# Altium project Extender_Remastered_V1.PrjPcb
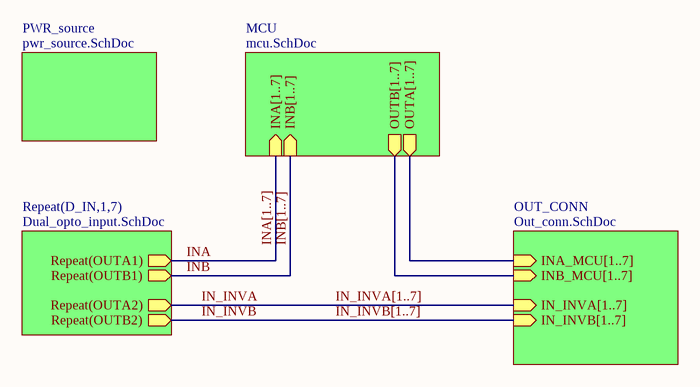
[diagram p0: main.SchDoc]
4 sheets, 123 parts. Net scope: hierarchical (ports join the sheet entries above them; power ports are global).
Board file: Extender_Remastered_V1.PcbDoc
Sheets:
  main.SchDoc
    D_IN1 = Dual_opto_input.SchDoc
    D_IN2 = Dual_opto_input.SchDoc
    D_IN3 = Dual_opto_input.SchDoc
    D_IN4 = Dual_opto_input.SchDoc
    D_IN5 = Dual_opto_input.SchDoc
    D_IN6 = Dual_opto_input.SchDoc
    D_IN7 = Dual_opto_input.SchDoc
    MCU = mcu.SchDoc
    OUT_CONN = Out_conn.SchDoc

## Sheet main.SchDoc
size A4; DocumentNumber: 1; SheetNumber: 1; SheetTotal: 5

### Sub-sheets
MCU = mcu.SchDoc: INA[1..7] (in), INB[1..7] (in), OUTB[1..7] (out), OUTA[1..7] (out)
OUT_CONN = Out_conn.SchDoc: IN_INVA[1..7] (in), IN_INVB[1..7] (in), INA_MCU[1..7] (in), INB_MCU[1..7] (in)
PWR_source = pwr_source.SchDoc (file not in this document): no entries
Repeat(D_IN,1,7) = Dual_opto_input.SchDoc: Repeat(OUTA1) (out), Repeat(OUTB1) (out), Repeat(OUTA2) (out), Repeat(OUTB2) (out)

### Nets
IN_INVA: sheet Repeat(D_IN,1,7)/Repeat(OUTA2)
IN_INVB: sheet Repeat(D_IN,1,7)/Repeat(OUTB2)
INA: sheet Repeat(D_IN,1,7)/Repeat(OUTA1)
INB: sheet Repeat(D_IN,1,7)/Repeat(OUTB1)

### Buses and harness runs
bus IN_INVA[1..7] = sheet OUT_CONN/IN_INVA[1..7]
bus IN_INVB[1..7] = sheet OUT_CONN/IN_INVB[1..7]
bus INA[1..7] = sheet MCU/INA[1..7]
bus INB[1..7] = sheet MCU/INB[1..7]
bus sheet MCU/OUTA[1..7] = sheet OUT_CONN/INA_MCU[1..7]
bus sheet MCU/OUTB[1..7] = sheet OUT_CONN/INB_MCU[1..7]

## Sheet Dual_opto_input.SchDoc
size A4; DocumentNumber: 2; SheetNumber: 2; SheetTotal: 5
Used 7 times, as channels D_IN1, D_IN2, D_IN3, D_IN4, D_IN5, D_IN6, D_IN7. Parts and nets are listed once, with the designators drawn on the sheet.
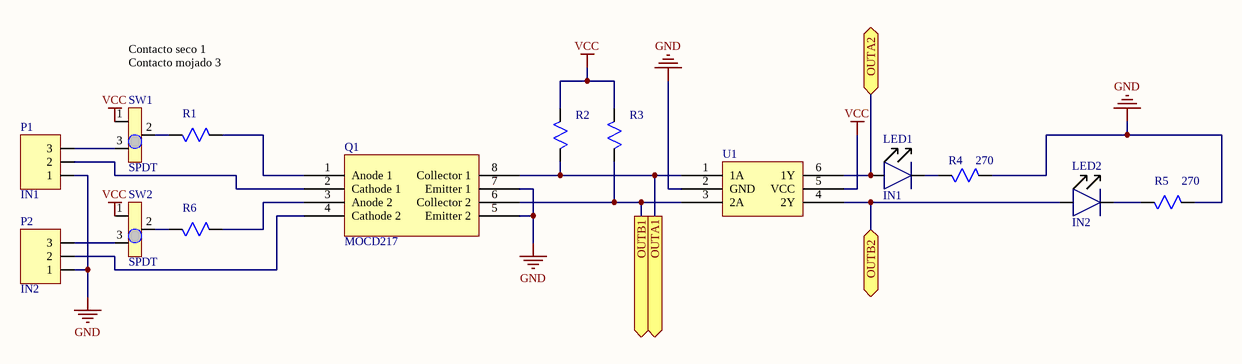
[diagram p1: Dual_opto_input.SchDoc]

### Parts
LED1  IN1  [SMD1206]
LED2  IN2  [SMD1206]
P1  IN1  [TBHDR3P3.5]
P2  IN2  [TBHDR3P3.5]
Q1  MOCD217  [SOIC8]
R1  (no value)  [ResistorSMD0805]
R2  (no value)  [ResistorSMD0805]
R3  (no value)  [ResistorSMD0805]
R4  270  [ResistorSMD0805]
R5  270  [ResistorSMD0805]
R6  (no value)  [ResistorSMD0805]
SW1  SPDT  [SPDT SMD]
SW2  SPDT  [SPDT SMD]
U1  Inverter2x2  [Inverter2x2]  (value not drawn)

### Ports
OUTA1 (out), OUTA2, OUTB1 (out), OUTB2

### Nets
GND: P1.1 P2.1 Q1.5(Emitter_2) Q1.7(Emitter_1) R4.1 R5.1 U1.2(GND)
VCC: R2.1 R3.1 SW1.1 SW2.1 U1.5(VCC)
OUTA1: Q1.8(Collector_1) R2.2 U1.1(1A) ; port OUTA1
OUTA2: LED1.2 U1.6(1Y) ; port OUTA2
OUTB1: Q1.6(Collector_2) R3.2 U1.3(2A) ; port OUTB1
OUTB2: LED2.2 U1.4(2Y) ; port OUTB2
NetLED1_1: LED1.1 R4.2
NetLED2_1: LED2.1 R5.2
NetP1_2: P1.2 Q1.2(Cathode_1)
NetP1_3: P1.3 SW1.3
NetP2_2: P2.2 Q1.4(Cathode_2)
NetP2_3: P2.3 SW2.3
NetQ1_1: Q1.1(Anode_1) R1.1
NetQ1_3: Q1.3(Anode_2) R6.1
NetR1_2: R1.2 SW1.2
NetR6_2: R6.2 SW2.2

### Channels
D_IN1: designators end in A; ports OUTA1=INA1 OUTA2=IN_INVA1 OUTB1=INB1 OUTB2=IN_INVB1
D_IN2: designators end in B; ports OUTA1=INA2 OUTA2=IN_INVA2 OUTB1=INB2 OUTB2=IN_INVB2
D_IN3: designators end in C; ports OUTA1=INA3 OUTA2=IN_INVA3 OUTB1=INB3 OUTB2=IN_INVB3
D_IN4: designators end in D; ports OUTA1=INA4 OUTA2=IN_INVA4 OUTB1=INB4 OUTB2=IN_INVB4
D_IN5: designators end in E; ports OUTA1=INA5 OUTA2=IN_INVA5 OUTB1=INB5 OUTB2=IN_INVB5
D_IN6: designators end in F; ports OUTA1=INA6 OUTA2=IN_INVA6 OUTB1=INB6 OUTB2=IN_INVB6
D_IN7: designators end in G; ports OUTA1=INA7 OUTA2=IN_INVA7 OUTB1=INB7 OUTB2=IN_INVB7

### Notes on the sheet
- Contacto seco 1
  Contacto mojado 3

### Library data of the parts
LED1 LED2 = LedSMD: Discrete Led SMD; Manufacturer Name: Lite-On Inc.; Manufacturers Part Number: LTST-C150GKT; PartDescription: LED GREEN CLEAR 1206 SMD; Digi-Key Part Number: 160-1169-1-ND; Package: 1206 (3216 Metric); Type: SMD
P1 P2 = TBHDR3P3.5: Connector 3 positions with pitch 3.5mm; Manufacturer Name: Phoenix Contact; Manufacturers Part Number: 1897102; PartDescription: TERM BLOCK HDR 3POS 90DEG 3.5MM; Accesorios PN: 277-2413-ND; Digi-Key Part Number: 277-11008-ND; Package: 3POS; Type: Thru-hole
Q1 = MOCD217: Optocoupler; Manufacturer Name: ON Semiconductor; Manufacturers Part Number: MOCD217R2M; PartDescription: OPTOISO 2.5KV 2CH TRANS 8SOIC; Type: SMD; Digi-Key Part Number: MOCD217R2MCT-ND; Package: 8-SOIC
R1-R3 R6 = ResistorSMD: Chip Resistor SMD; Manufacturer Name: Yageo; Manufacturers Part Number: RC0805FR-07680RL; PartDescription: RES SMD 680 OHM 1% 1/8W 0805; Digi-Key Part Number: 311-680CRCT-ND; Package: 0805; Type: SMD
R4 R5 = ResistorSMD: Chip Resistor SMD; Manufacturer Name: Yageo; Manufacturers Part Number: AC0805FR-07270RL; PartDescription: RES SMD 270 OHM 1% 1/8W 0805; Digi-Key Part Number: YAG3714CT-ND; Package: 0805; value: 270; Type: SMD
SW1 SW2 = SW_SPDT: 200mA 12V; Manufacturer Name: Nidec Copal Electronics; Manufacturers Part Number: CL-SB-12B-01T; PartDescription: SWITCH SLIDE SPDT 200MA 12V; Digi-Key Part Number: 563-1318-1-ND; Package: SMD; Type: SMD
U1 = Inverter2x2: Logic Inverter 2 Circuits; Manufacturer Name: Texas Instruments; Manufacturers Part Number: SN74AUP2G14DCKR; PartDescription: IC INVERTER SCHMITT 2CH SC70-6; Digi-Key Part Number: 296-27361-1-ND; Package: SC-70-6; Type: SMD

## Sheet mcu.SchDoc
size A4; DocumentNumber: 3; SheetNumber: 3; SheetTotal: 5
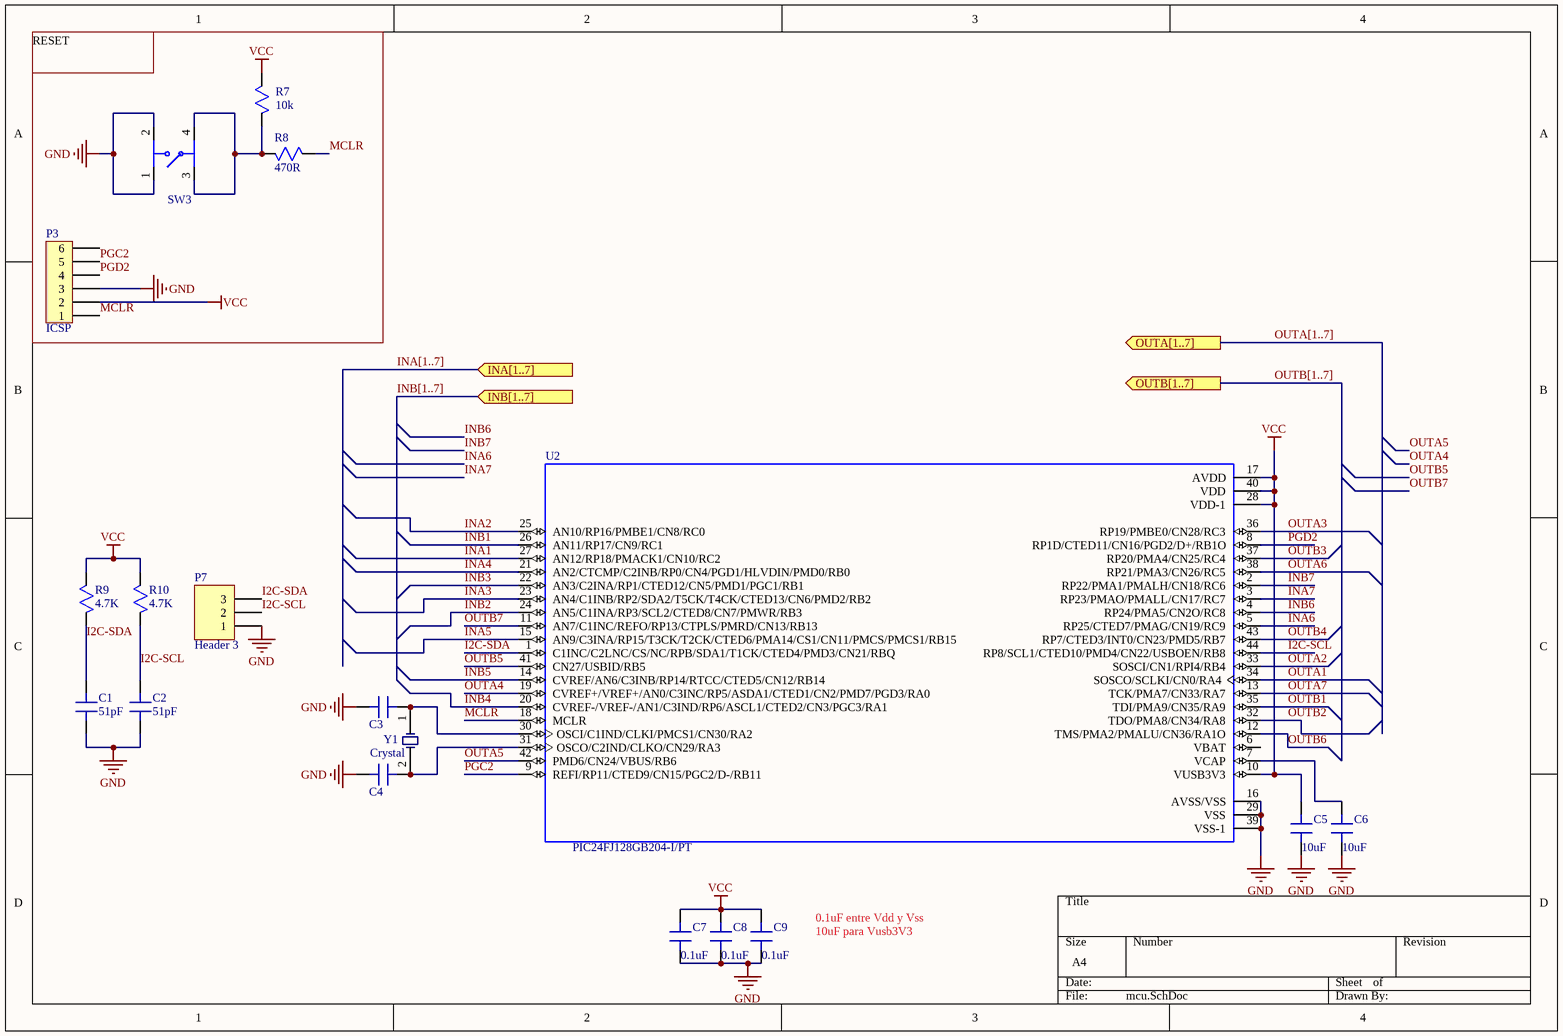
[diagram p2: mcu.SchDoc]

### Parts
C1  51pF  [Capacitor0805]
C2  51pF  [Capacitor0805]
C3  6pF  [Capacitor0805]  (value not drawn)
C4  6pF  [Capacitor0805]  (value not drawn)
C5  10uF  [Capacitor0805]
C6  10uF  [Capacitor0805]
C7  0.1uF  [Capacitor0805]
C8  0.1uF  [Capacitor0805]
C9  0.1uF  [Capacitor0805]
P3  ICSP  [MALE6PIN]
P7  Header 3  [HDR1X3]
R7  10k  [ResistorSMD0805]
R8  470R  [ResistorSMD0805]
R9  4.7K  [ResistorSMD0805]
R10  4.7K  [ResistorSMD0805]
SW3  Tactile Switch  [TactileSwitch]  (value not drawn)
U2  PIC24FJ128GB204-I/PT  [QFP80P1200X1200X120-44N]
Y1  Crystal  [CRYSTALSMDMini]

### Ports
INA[1..7] (in), INB[1..7] (in), OUTA[1..7] (out), OUTB[1..7] (out)

### Nets
GND: C1.2 C2.2 C3.1 C4.1 C5.1 C6.1 C7.1 C8.1 C9.1 P3.3 P7.1 SW3.1 SW3.2 U2.16(AVSS/VSS) U2.29(VSS) U2.39(VSS-1)
VCC: C5.2 C7.2 C8.2 C9.2 P3.2 R7.2 R9.2 R10.2 U2.10(VUSB3V3) U2.17(AVDD) U2.28(VDD-1) U2.40(VDD)
I2C-SCL: C2.1 P7.2 R10.1 U2.44(RP8/SCL1/CTED10/PMD4/CN22/USBOEN/RB8)
I2C-SDA: C1.1 P7.3 R9.1 U2.1(C1INC/C2LNC/CS/NC/RPB/SDA1/T1CK/CTED4/PMD3/CN21/RBQ)
INA1: U2.27(AN12/RP18/PMACK1/CN10/RC2)
INA2: U2.25(AN10/RP16/PMBE1/CN8/RC0)
INA3: U2.23(AN4/C1INB/RP2/SDA2/T5CK/T4CK/CTED13/CN6/PMD2/RB2)
INA4: U2.21(AN2/CTCMP/C2INB/RP0/CN4/PGD1/HLVDIN/PMD0/RB0)
INA5: U2.15(AN9/C3INA/RP15/T3CK/T2CK/CTED6/PMA14/CS1/CN11/PMCS/PMCS1/RB15)
INA6: U2.5(RP25/CTED7/PMAG/CN19/RC9)
INA7: U2.3(RP23/PMAO/PMALL/CN17/RC7)
INB1: U2.26(AN11/RP17/CN9/RC1)
INB2: U2.24(AN5/C1INA/RP3/SCL2/CTED8/CN7/PMWR/RB3)
INB3: U2.22(AN3/C2INA/RP1/CTED12/CN5/PMD1/PGC1/RB1)
INB4: U2.20(CVREF-/VREF-/AN1/C3IND/RP6/ASCL1/CTED2/CN3/PGC3/RA1)
INB5: U2.14(CVREF/AN6/C3INB/RP14/RTCC/CTED5/CN12/RB14)
INB6: U2.4(RP24/PMA5/CN2O/RC8)
INB7: U2.2(RP22/PMA1/PMALH/CN18/RC6)
MCLR: P3.1 R8.2 U2.18(MCLR)
OUTA1: U2.34(SOSCO/SCLKI/CN0/RA4)  [project net INA_MCU1]
OUTA2: U2.33(SOSCI/CN1/RPI4/RB4)  [project net INA_MCU2]
OUTA3: U2.36(RP19/PMBE0/CN28/RC3)  [project net INA_MCU3]
OUTA4: U2.19(CVREF+/VREF+/AN0/C3INC/RP5/ASDA1/CTED1/CN2/PMD7/PGD3/RA0)  [project net INA_MCU4]
OUTA5: U2.42(PMD6/CN24/VBUS/RB6)  [project net INA_MCU5]
OUTA6: U2.38(RP21/PMA3/CN26/RC5)  [project net INA_MCU6]
OUTA7: U2.13(TCK/PMA7/CN33/RA7)  [project net INA_MCU7]
OUTB1: U2.35(TDI/PMA9/CN35/RA9)  [project net INB_MCU1]
OUTB2: U2.32(TDO/PMA8/CN34/RA8)  [project net INB_MCU2]
OUTB3: U2.37(RP20/PMA4/CN25/RC4)  [project net INB_MCU3]
OUTB4: U2.43(RP7/CTED3/INT0/CN23/PMD5/RB7)  [project net INB_MCU4]
OUTB5: U2.41(CN27/USBID/RB5)  [project net INB_MCU5]
OUTB6: U2.12(TMS/PMA2/PMALU/CN36/RA1O)  [project net INB_MCU6]
OUTB7: U2.11(AN7/C1INC/REFO/RP13/CTPLS/PMRD/CN13/RB13)  [project net INB_MCU7]
PGC2: P3.5 U2.9(REFI/RP11/CTED9/CN15/PGC2/D-/RB11)
PGD2: P3.4 U2.8(RP1D/CTED11/CN16/PGD2/D+/RB1O)
NetC3_2: C3.2 U2.30(OSCI/C1IND/CLKI/PMCS1/CN30/RA2) Y1.1
NetC4_2: C4.2 U2.31(OSCO/C2IND/CLKO/CN29/RA3) Y1.2
NetC6_2: C6.2 U2.7(VCAP)
NetR7_1: R7.1 R8.1 SW3.3 SW3.4

Not connected (* = marked no-connect by the designer): P3 6; U2 6(VBAT)

### Buses and harness runs
bus INA[1..7] = port INA[1..7]
bus INB[1..7] = port INB[1..7]
bus OUTA[1..7] = port OUTA[1..7]
bus OUTB[1..7] = port OUTB[1..7]

### Notes on the sheet
- RESET
- 0.1uF entre Vdd y Vss
  10uF para Vusb3V3

### Library data of the parts
C1 C2 = CapacitorSMD: Ceramic Capacitor; Manufacturer Name: Yageo; Manufacturers Part Number: CC0805JRNPO0BN510; PartDescription: CAP CER 51PF 50V C0G/NP0 0805; Type: SMD; Digi-Key Part Number: 311-4223-1-ND; Value: 51pF; Package: 0805
C3 C4 = CapacitorSMD: Ceramic Capacitor; Manufacturer Name: Yageo; Manufacturers Part Number: CC0805CRNPO9BN6R0; PartDescription: CAP CER 6PF 50V NP0 0805; Type: SMD; Digi-Key Part Number: 311-4149-1-ND; Value: 6pF; Package: 0805
C5 C6 = CapacitorSMD: Ceramic Capacitor; Manufacturer Name: Yageo; Manufacturers Part Number: CC0805ZKY5V6BB106; PartDescription: CAP CER 10UF 10V Y5V 0805; Type: SMD; Value: 10uF; Digi-Key Part Number: 311-1355-1-ND; Package: 0805
C7-C9 = CapacitorSMD: Ceramic Capacitor; Manufacturer Name: Yageo; Manufacturers Part Number: CC0805KRX7R8BB104; PartDescription: CAP CER 0.1UF 25V X7R 0805; Type: SMD; Value: 0.1uF; Digi-Key Part Number: 311-1141-1-ND
  C7: package: 0805
  C8 C9: Package: 0805
P3 = PHM1x6P2.54: Pin Header Male 6 Pins Pitch 2.54mm; Manufacturer Name: Harwin Inc.; Manufacturers Part Number: M20-9990645; PartDescription: CONN HEADER VERT 6POS 2.54MM; Digi-Key Part Number: 952-2269-ND; Package: 6POS; Type: Thru-hole
P7 = Header 3: Header, 3-Pin
R7 = ResistorSMD: Chip Resistor SMD; Manufacturer Name: Yageo; Manufacturers Part Number: RC0805JR-0710KL; PartDescription: RES SMD 10K OHM 5% 1/8W 0805; Digi-Key Part Number: 311-10KARCT-ND; Value: 10k; Package: 0805; Type: SMD
R8 = ResistorSMD: Chip Resistor SMD; Manufacturer Name: Yageo; Manufacturers Part Number: RC0805FR-07470RL; PartDescription: RES SMD 470 OHM 1% 1/8W 0805; Digi-Key Part Number: 311-470CRCT-ND; Value: 470R; Package: 0805; Type: SMD
R9 R10 = ResistorSMD: Chip Resistor SMD; Manufacturer Name: Yageo; Manufacturers Part Number: RC0805FR-074K7L; PartDescription: RES SMD 4.7K OHM 1% 1/8W 0805; Digi-Key Part Number: 311-4.70KCRCT-ND; Value: 4.7K; Package: 0805; Type: SMD
SW3 = Tactile Switch: Switch Contact; Manufacturer Name: C&K; Manufacturers Part Number: PTS645SM43SMTR92 LFS; PartDescription: SWITCH TACTILE SPST-NO 0.05A 12V; Digi-Key Part Number: CKN9112CT-ND; Package: 6.00mm x 6.00mm; Type: SMD
U2 = PIC24FJ128GB204-I/PT: 128KB Flash, 8KB RAM, 16 MIPS, USB OTG, Crypto, 44 TQFP 10x10x1mm TRAY; Manufacturer Name: Microchip; PartDescription: IC MCU 16BIT 128KB FLASH 44TQFP; Package: 44-TQFP; Digi-Key Part Number: PIC24FJ128GB204-I/PT-ND; Manufacturers Part Number: PIC24FJ128GB204-I/PT; Type: SMD
Y1 = Crystal: Crystal SMD; Manufacturer Name: ECS Inc.; Manufacturers Part Number: ECS-240-8-30B-CKM; PartDescription: CRYSTAL 24.0000MHZ 8PF SMD; Value: 24MHz; Digi-Key Part Number: XC1842CT-ND; Package: 4-SMD, No Lead; Type: SMD

## Sheet Out_conn.SchDoc
size A4; DocumentNumber: 4; SheetNumber: 4; SheetTotal: 5
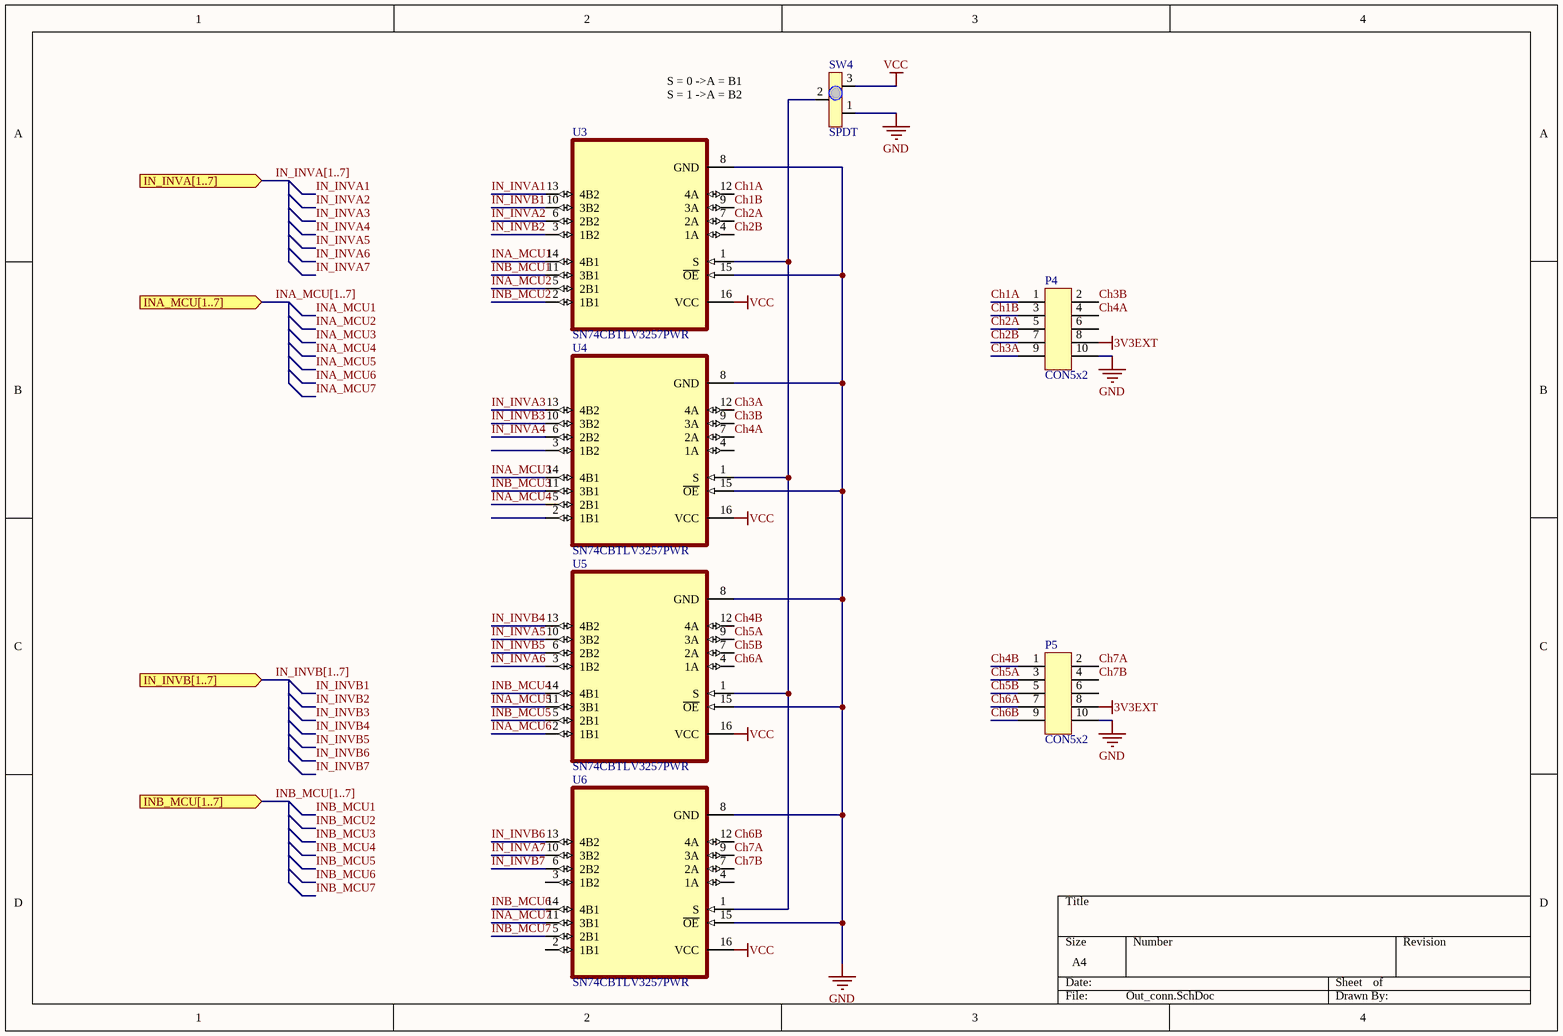
[diagram p3: Out_conn.SchDoc]

### Parts
P4  CON5x2  [TBBTB2x5]
P5  CON5x2  [TBBTB2x5]
SW4  SPDT  [SPDT SMD]
U3  SN74CBTLV3257PWR  [SOP65P640X120-16N]
U4  SN74CBTLV3257PWR  [SOP65P640X120-16N]
U5  SN74CBTLV3257PWR  [SOP65P640X120-16N]
U6  SN74CBTLV3257PWR  [SOP65P640X120-16N]

### Ports
IN_INVA[1..7] (in), IN_INVB[1..7] (in), INA_MCU[1..7] (in), INB_MCU[1..7] (in)

### Nets
3V3EXT: P4.8 P5.8
GND: P4.10 P5.10 SW4.1 U3.8(GND) U3.15(~{OE}) U4.8(GND) U4.15(~{OE}) U5.8(GND) U5.15(~{OE}) U6.8(GND) U6.15(~{OE})
VCC: SW4.3 U3.16(VCC) U4.16(VCC) U5.16(VCC) U6.16(VCC)
Ch1A: P4.1 U3.12(4A)
Ch1B: P4.3 U3.9(3A)
Ch2A: P4.5 U3.7(2A)
Ch2B: P4.7 U3.4(1A)
Ch3A: P4.9 U4.12(4A)
Ch3B: P4.2 U4.9(3A)
Ch4A: P4.4 U4.7(2A)
Ch4B: P5.1 U5.12(4A)
Ch5A: P5.3 U5.9(3A)
Ch5B: P5.5 U5.7(2A)
Ch6A: P5.7 U5.4(1A)
Ch6B: P5.9 U6.12(4A)
Ch7A: P5.2 U6.9(3A)
Ch7B: P5.4 U6.7(2A)
IN_INVA1: U3.13(4B2)
IN_INVA2: U3.6(2B2)
IN_INVA3: U4.13(4B2)
IN_INVA4: U4.6(2B2)
IN_INVA5: U5.10(3B2)
IN_INVA6: U5.3(1B2)
IN_INVA7: U6.10(3B2)
IN_INVB1: U3.10(3B2)
IN_INVB2: U3.3(1B2)
IN_INVB3: U4.10(3B2)
IN_INVB4: U5.13(4B2)
IN_INVB5: U5.6(2B2)
IN_INVB6: U6.13(4B2)
IN_INVB7: U6.6(2B2)
INA_MCU1: U3.14(4B1)
INA_MCU2: U3.5(2B1)
INA_MCU3: U4.14(4B1)
INA_MCU4: U4.5(2B1)
INA_MCU5: U5.11(3B1)
INA_MCU6: U5.2(1B1)
INA_MCU7: U6.11(3B1)
INB_MCU1: U3.11(3B1)
INB_MCU2: U3.2(1B1)
INB_MCU3: U4.11(3B1)
INB_MCU4: U5.14(4B1)
INB_MCU5: U5.5(2B1)
INB_MCU6: U6.14(4B1)
INB_MCU7: U6.5(2B1)
NetSW4_2: SW4.2 U3.1(S) U4.1(S) U5.1(S) U6.1(S)

Not connected (* = marked no-connect by the designer): P4 6; P5 6; U4 2(1B1) 3(1B2) 4(1A); U6 2(1B1) 3(1B2) 4(1A)

### Buses and harness runs
bus IN_INVA[1..7] = port IN_INVA[1..7]
bus IN_INVB[1..7] = port IN_INVB[1..7]
bus INA_MCU[1..7] = port INA_MCU[1..7]
bus INB_MCU[1..7] = port INB_MCU[1..7]

### Notes on the sheet
- S = 0 ->A = B1
  S = 1 ->A = B2

### Library data of the parts
P4 P5 = PH_5x2: Manufacturer Name: On Shore Technology Inc.; Manufacturers Part Number: 302-S101; PartDescription: CONN HEADER VERT 10POS 2.54MM; Accesorios PN: A3AAH-1006G-ND; Digi-Key Part Number: ED1543-ND; Package: 10POS; Type: Thru-hole
SW4 = SW_SPDT: as SW1 on sheet Dual_opto_input; Digi-Key Part Number: 563-1318-1-ND; Package: SMD; Type: SMD
U3-U6 = SN74CBTLV3257PWR: Multiplexer/Demultiplexer 4 x 1:2 16-TSSOP; Manufacturer Name: Texas Instruments; PartDescription: IC LV FET MUX/DEMUX 16-TSSOP; Package: TSSOP-16; Digi-Key Part Number: 296-9138-1-ND; Manufacturers Part Number: SN74CBTLV3257PWR; Type: SMD

## Nets that join several sheets
GND: D_IN1 (7 pins), D_IN2 (7 pins), D_IN3 (7 pins), D_IN4 (7 pins), D_IN5 (7 pins), D_IN6 (7 pins), D_IN7 (7 pins), mcu (16 pins), Out_conn (11 pins)
VCC: D_IN1 (5 pins), D_IN2 (5 pins), D_IN3 (5 pins), D_IN4 (5 pins), D_IN5 (5 pins), D_IN6 (5 pins), D_IN7 (5 pins), mcu (12 pins), Out_conn (5 pins)
IN_INVA1: D_IN1 (LED1A.2 U1A.6), Out_conn (U3.13)
IN_INVA2: D_IN2 (LED1B.2 U1B.6), Out_conn (U3.6)
IN_INVA3: D_IN3 (LED1C.2 U1C.6), Out_conn (U4.13)
IN_INVA4: D_IN4 (LED1D.2 U1D.6), Out_conn (U4.6)
IN_INVA5: D_IN5 (LED1E.2 U1E.6), Out_conn (U5.10)
IN_INVA6: D_IN6 (LED1F.2 U1F.6), Out_conn (U5.3)
IN_INVA7: D_IN7 (LED1G.2 U1G.6), Out_conn (U6.10)
IN_INVB1: D_IN1 (LED2A.2 U1A.4), Out_conn (U3.10)
IN_INVB2: D_IN2 (LED2B.2 U1B.4), Out_conn (U3.3)
IN_INVB3: D_IN3 (LED2C.2 U1C.4), Out_conn (U4.10)
IN_INVB4: D_IN4 (LED2D.2 U1D.4), Out_conn (U5.13)
IN_INVB5: D_IN5 (LED2E.2 U1E.4), Out_conn (U5.6)
IN_INVB6: D_IN6 (LED2F.2 U1F.4), Out_conn (U6.13)
IN_INVB7: D_IN7 (LED2G.2 U1G.4), Out_conn (U6.6)
INA1: D_IN1 (Q1A.8 R2A.2 U1A.1), mcu (U2.27)
INA2: D_IN2 (Q1B.8 R2B.2 U1B.1), mcu (U2.25)
INA3: D_IN3 (Q1C.8 R2C.2 U1C.1), mcu (U2.23)
INA4: D_IN4 (Q1D.8 R2D.2 U1D.1), mcu (U2.21)
INA5: D_IN5 (Q1E.8 R2E.2 U1E.1), mcu (U2.15)
INA6: D_IN6 (Q1F.8 R2F.2 U1F.1), mcu (U2.5)
INA7: D_IN7 (Q1G.8 R2G.2 U1G.1), mcu (U2.3)
INA_MCU1: mcu (U2.34), Out_conn (U3.14)
INA_MCU2: mcu (U2.33), Out_conn (U3.5)
INA_MCU3: mcu (U2.36), Out_conn (U4.14)
INA_MCU4: mcu (U2.19), Out_conn (U4.5)
INA_MCU5: mcu (U2.42), Out_conn (U5.11)
INA_MCU6: mcu (U2.38), Out_conn (U5.2)
INA_MCU7: mcu (U2.13), Out_conn (U6.11)
INB1: D_IN1 (Q1A.6 R3A.2 U1A.3), mcu (U2.26)
INB2: D_IN2 (Q1B.6 R3B.2 U1B.3), mcu (U2.24)
INB3: D_IN3 (Q1C.6 R3C.2 U1C.3), mcu (U2.22)
INB4: D_IN4 (Q1D.6 R3D.2 U1D.3), mcu (U2.20)
INB5: D_IN5 (Q1E.6 R3E.2 U1E.3), mcu (U2.14)
INB6: D_IN6 (Q1F.6 R3F.2 U1F.3), mcu (U2.4)
INB7: D_IN7 (Q1G.6 R3G.2 U1G.3), mcu (U2.2)
INB_MCU1: mcu (U2.35), Out_conn (U3.11)
INB_MCU2: mcu (U2.32), Out_conn (U3.2)
INB_MCU3: mcu (U2.37), Out_conn (U4.11)
INB_MCU4: mcu (U2.43), Out_conn (U5.14)
INB_MCU5: mcu (U2.41), Out_conn (U5.5)
INB_MCU6: mcu (U2.12), Out_conn (U6.14)
INB_MCU7: mcu (U2.11), Out_conn (U6.5)